# EAGLE schematic BLDC conmutation module (EAGLE 9.6.2)
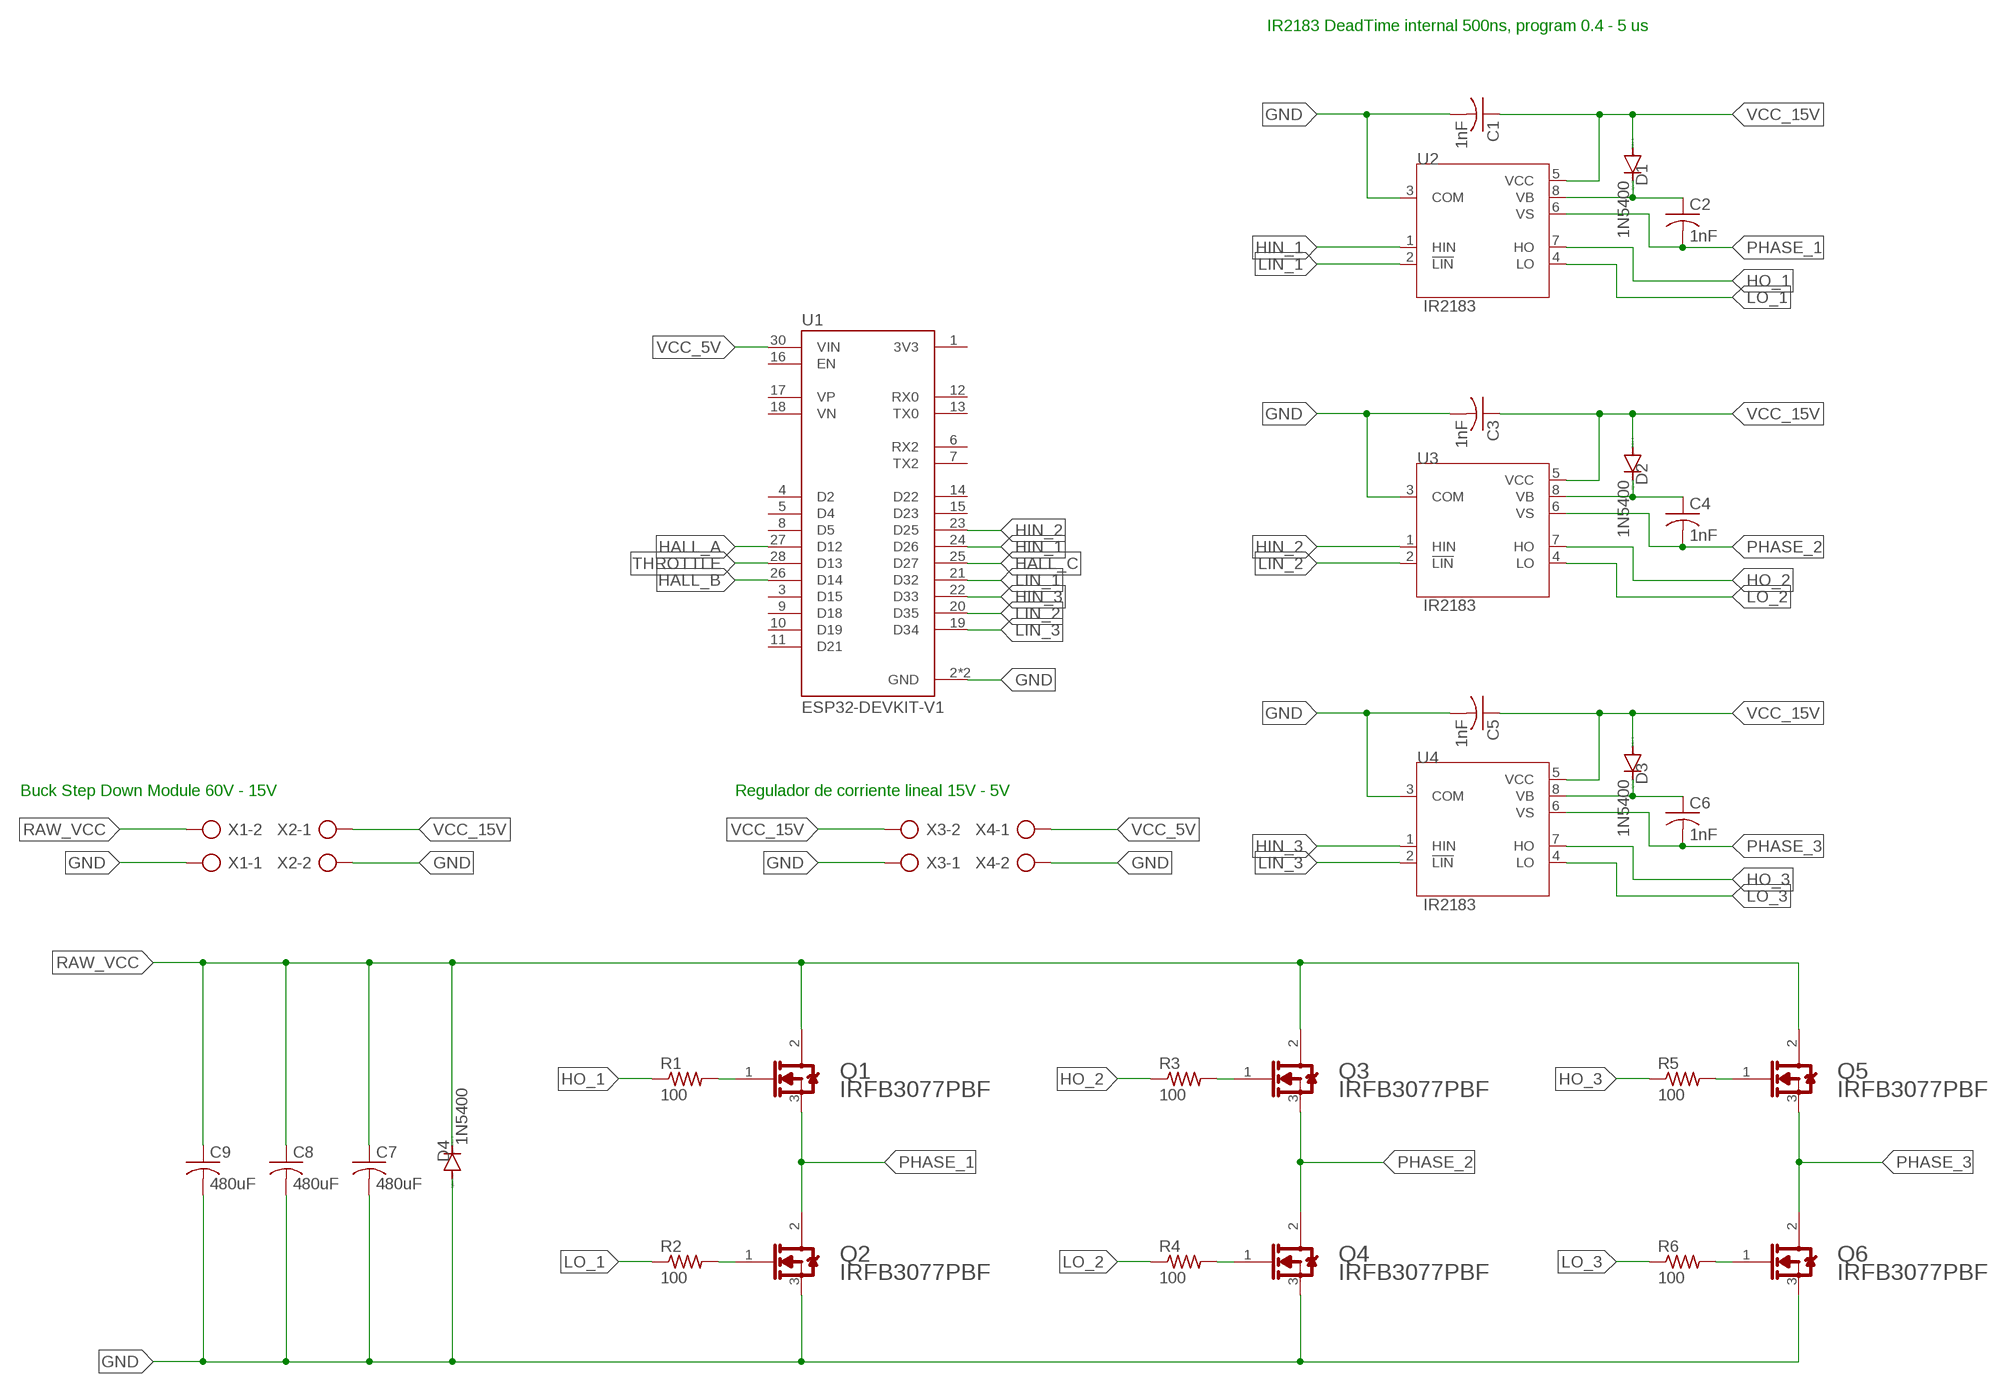
[diagram p0: schematic, sheet 1]

## Parts
C1  1nF  C-US025-050X050  [C025-050X050]
C2  1nF  C-US025-050X050  [C025-050X050]
C3  1nF  C-US025-050X050  [C025-050X050]
C4  1nF  C-US025-050X050  [C025-050X050]
C5  1nF  C-US025-050X050  [C025-050X050]
C6  1nF  C-US025-050X050  [C025-050X050]
C7  480uF  C-US025-050X050  [C025-050X050]
C8  480uF  C-US025-050X050  [C025-050X050]
C9  480uF  C-US025-050X050  [C025-050X050]
D1  1N5400  [DO201-15]
D2  1N5400  [DO201-15]
D3  1N5400  [DO201-15]
D4  1N5400  [DO201-15]
Q1  INFINEON_IRFB3077PBFINFINEON_IRFB3077PBF_0_0  [INFINEON_IRFB3077PBF_0]
Q2  INFINEON_IRFB3077PBFINFINEON_IRFB3077PBF_0_0  [INFINEON_IRFB3077PBF_0]
Q3  INFINEON_IRFB3077PBFINFINEON_IRFB3077PBF_0_0  [INFINEON_IRFB3077PBF_0]
Q4  INFINEON_IRFB3077PBFINFINEON_IRFB3077PBF_0_0  [INFINEON_IRFB3077PBF_0]
Q5  INFINEON_IRFB3077PBFINFINEON_IRFB3077PBF_0_0  [INFINEON_IRFB3077PBF_0]
Q6  INFINEON_IRFB3077PBFINFINEON_IRFB3077PBF_0_0  [INFINEON_IRFB3077PBF_0]
R1  100  R-US_0207/10  [0207/10]
R2  100  R-US_0207/10  [0207/10]
R3  100  R-US_0207/10  [0207/10]
R4  100  R-US_0207/10  [0207/10]
R5  100  R-US_0207/10  [0207/10]
R6  100  R-US_0207/10  [0207/10]
U1  ESP32-DEVKIT-V1  [MODULE_ESP32_DEVKIT_V1]
U2  IR2183  [DIP762W45P254L1092H533Q8]
U3  IR2183  [DIP762W45P254L1092H533Q8]
U4  IR2183  [DIP762W45P254L1092H533Q8]
X1  AK500/2-H  [AK500/2-H]
X2  AK500/2-H  [AK500/2-H]
X3  AK500/2-H  [AK500/2-H]
X4  AK500/2-H  [AK500/2-H]

## Nets
GND: C1.2 C3.2 C5.2 C7.2 C8.2 C9.2 D4.A Q2.3(S) Q4.3(S) Q6.3(S) U1.2(GND) U1.29(GND) U2.3(COM) U3.3(COM) U4.3(COM) X1.1 X2.2 X3.1 X4.2
HALL_A: U1.27(D12)
HALL_B: U1.26(D14)
HALL_C: U1.25(D27)
HIN_1: U1.24(D26) U2.1(HIN)
HIN_2: U1.23(D25) U3.1(HIN)
HIN_3: U1.22(D33) U4.1(HIN)
HO_1: R1.1 U2.7(HO)
HO_2: R3.1 U3.7(HO)
HO_3: R5.1 U4.7(HO)
LIN_1: U1.21(D32) U2.2(!LIN)
LIN_2: U1.20(D35) U3.2(!LIN)
LIN_3: U1.19(D34) U4.2(!LIN)
LO_1: R2.1 U2.4(LO)
LO_2: R4.1 U3.4(LO)
LO_3: R6.1 U4.4(LO)
N$1: C4.1 D2.C U3.8(VB)
N$2: C6.1 D3.C U4.8(VB)
N$3: C2.1 D1.C U2.8(VB)
N$6: Q3.1(G) R3.2
N$7: Q1.1(G) R1.2
N$8: Q2.1(G) R2.2
N$9: Q4.1(G) R4.2
N$11: Q5.1(G) R5.2
N$12: Q6.1(G) R6.2
PHASE_1: C2.2 Q1.3(S) Q2.2(D) U2.6(VS)
PHASE_2: C4.2 Q3.3(S) Q4.2(D) U3.6(VS)
PHASE_3: C6.2 Q5.3(S) Q6.2(D) U4.6(VS)
RAW_VCC: C7.1 C8.1 C9.1 D4.C Q1.2(D) Q3.2(D) Q5.2(D) X1.2
THROTTLE: U1.28(D13)
VCC_5V: U1.30(VIN) X4.1
VCC_15V: C1.1 C3.1 C5.1 D1.A D2.A D3.A U2.5(VCC) U3.5(VCC) U4.5(VCC) X2.1 X3.2
Unconnected: U1.1(3V3) U1.3(D15) U1.4(D2) U1.5(D4) U1.6(RX2) U1.7(TX2) U1.8(D5) U1.9(D18) U1.10(D19) U1.11(D21) U1.12(RX0) U1.13(TX0) U1.14(D22) U1.15(D23) U1.16(EN) U1.17(VP) U1.18(VN)

## Notes on the sheet
- IR2183 DeadTime internal 500ns, program 0.4 - 5 us
- Buck Step Down Module 60V - 15V | Regulador de corriente lineal 15V - 5V

## Library data of the parts
C1-C9 = rcl:C-US: CAPACITOR, American symbol; SPICEPREFIX: C
D1-D4 = diode:1N5400: DIODE standard rectifier, 3 A, 50 V (Motorola)
Q1-Q6 = Infineon - IRFB3077PBF:INFINEON_IRFB3077PBF: N-Channel 75 V 120A (Tc) 370W (Tc) Through Hole TO-220AB; AUTOMOTIVE: No; CENTROID_NOT_SPECIFIED: No; CONTINUOUS_DRAIN_CURRENT: 210A; DATASHEET: https://www.infineon.com/dgdl/Infineon-IRFB3077-DataSheet-v01_01-EN.pdf?fileId=5546d462533600a4015356153f0d1def; DEPLETION_MODE: False; DEVICE_CLASS_L1: Discrete Semiconductors; DEVICE_CLASS_L2: Transistors; DEVICE_CLASS_L3: MOSFETs; DIGIKEY_DESCRIPTION: MOSFET N-CH 75V 120A TO220AB; DIGIKEY_PART_NUMBER: IRFB3077PBF-ND; DRAIN_TO_SOURCE_BREAKDOWN_VOLTAGE: 75V; DRAIN_TO_SOURCE_RESISTANCE: 2.8mΩ; DRAIN_TO_SOURCE_VOLTAGE: 75V; FOOTPRINT_URL: https://www.infineon.com/cms/en/product/packages/PG-TO220/PG-TO220-3-904/; FOOTPRINT_VARIANT_NAME_0: Recommended_Land_Pattern; GATE_CHARGE_AT_VGS: 160nC @ 10V; GATE_TO_SOURCE_VOLTAGE: 20V; HEIGHT: 19.15mm; INPUT_CAPACITACE_AT_VDS: 9400pF @ 50V; LEAD_FREE: Yes; MAX_FORWARD_DIODE_VOLTAGE: 1.3V; MAX_JUNCTION_TEMP: +175°C; MF: Infineon; MFG_PACKAGE_IDENT: PG-TO220-3; MFG_PACKAGE_IDENT_COMPONENT_ID: 23a5373a371ebf18; MFG_PACKAGE_IDENT_DATE: 0; MFG_PACKAGE_IDENT_REV: 904; MOUSER_PART_NUMBER: 942-IRFB3077PBF; MPN: IRFB3077PBF; NUMBER_OF_CHANNELS: 1; NUMBER_OF_N_CHANNELS: 1; PACKAGE: TO-220AB; POWER_DISSIPATION: 370W; PREFIX: Q; PULSE_DRAIN_CURRENT: 850A; REVERSE_RECOVERY_CHARGE: 59nC; REVERSE_RECOVERY_TIME: 42ns; ROHS: Yes; RTHJA_MAX: 62°C/W; STANDOFF_HEIGHT: 3.56mm; TECHNOLOGY: NA; TEMPERATURE_RANGE_HIGH: +175°C; TEMPERATURE_RANGE_LOW: -55°C; THRESHOLD_VGS_MAX: 4V; THRESHOLD_VGS_MIN: 2V; TURN_OFF_DELAY_TIME: 69ns; TURN_ON_DELAY_TIME: 25ns; VERIFICATION_VERSION: 0.0.0.3
R1-R6 = rcl:R-US_: RESISTOR, American symbol; SPICEPREFIX: R
U1 = ESP32-DEVKIT-V1:ESP32-DEVKIT-V1: Dual core, Wi-Fi: 2.4 GHz up to 150 Mbits/s,BLE (Bluetooth Low Energy) and legacy Bluetooth, 32 bits, Up to 240 MHz Check availability <https://pricing.snapeda.com/parts/ESP32-DEVKIT-V1/Do%20it/view-part?ref=eda>; AVAILABILITY: Not in stock; DESCRIPTION: Dual core, Wi-Fi: 2.4 GHz up to 150 Mbits/s,BLE (Bluetooth Low Energy) and legacy Bluetooth, 32 bits, Up to 240 MHz; MF: Do it; MP: ESP32-DEVKIT-V1; PACKAGE: None; PRICE: None
U2-U4 = IR2183:IR2183: MOSFET DRVR 600V 2.3A 2-OUT Hi/Lo Side Half Brdg Inv/Non-Inv 8-Pin PDIP Check availability <https://pricing.snapeda.com/parts/IR2183/Infineon/view-part?ref=eda>; AVAILABILITY: In Stock; DESCRIPTION: Half-Bridge Gate Driver IC Inverting, Non-Inverting 14-SOIC; MF: Infineon; MP: IR2183; PACKAGE: DIP-8 International Rectifier; PRICE: None; PURCHASE-URL: https://pricing.snapeda.com/search/part/IR2183/?ref=eda
X1-X4 = con-ptr500:AK500/2-H: CONNECTOR Aug. 2004 / PTR Meßtechnik: Die Bezeichnung der Serie AK505 wurde geändert. Es handelt sich hierbei um AK500 in horizontaler Ausführung.; OC_FARNELL: unknown; OC_NEWARK: unknown